# EAGLE design hdmilight (EAGLE 6.4)
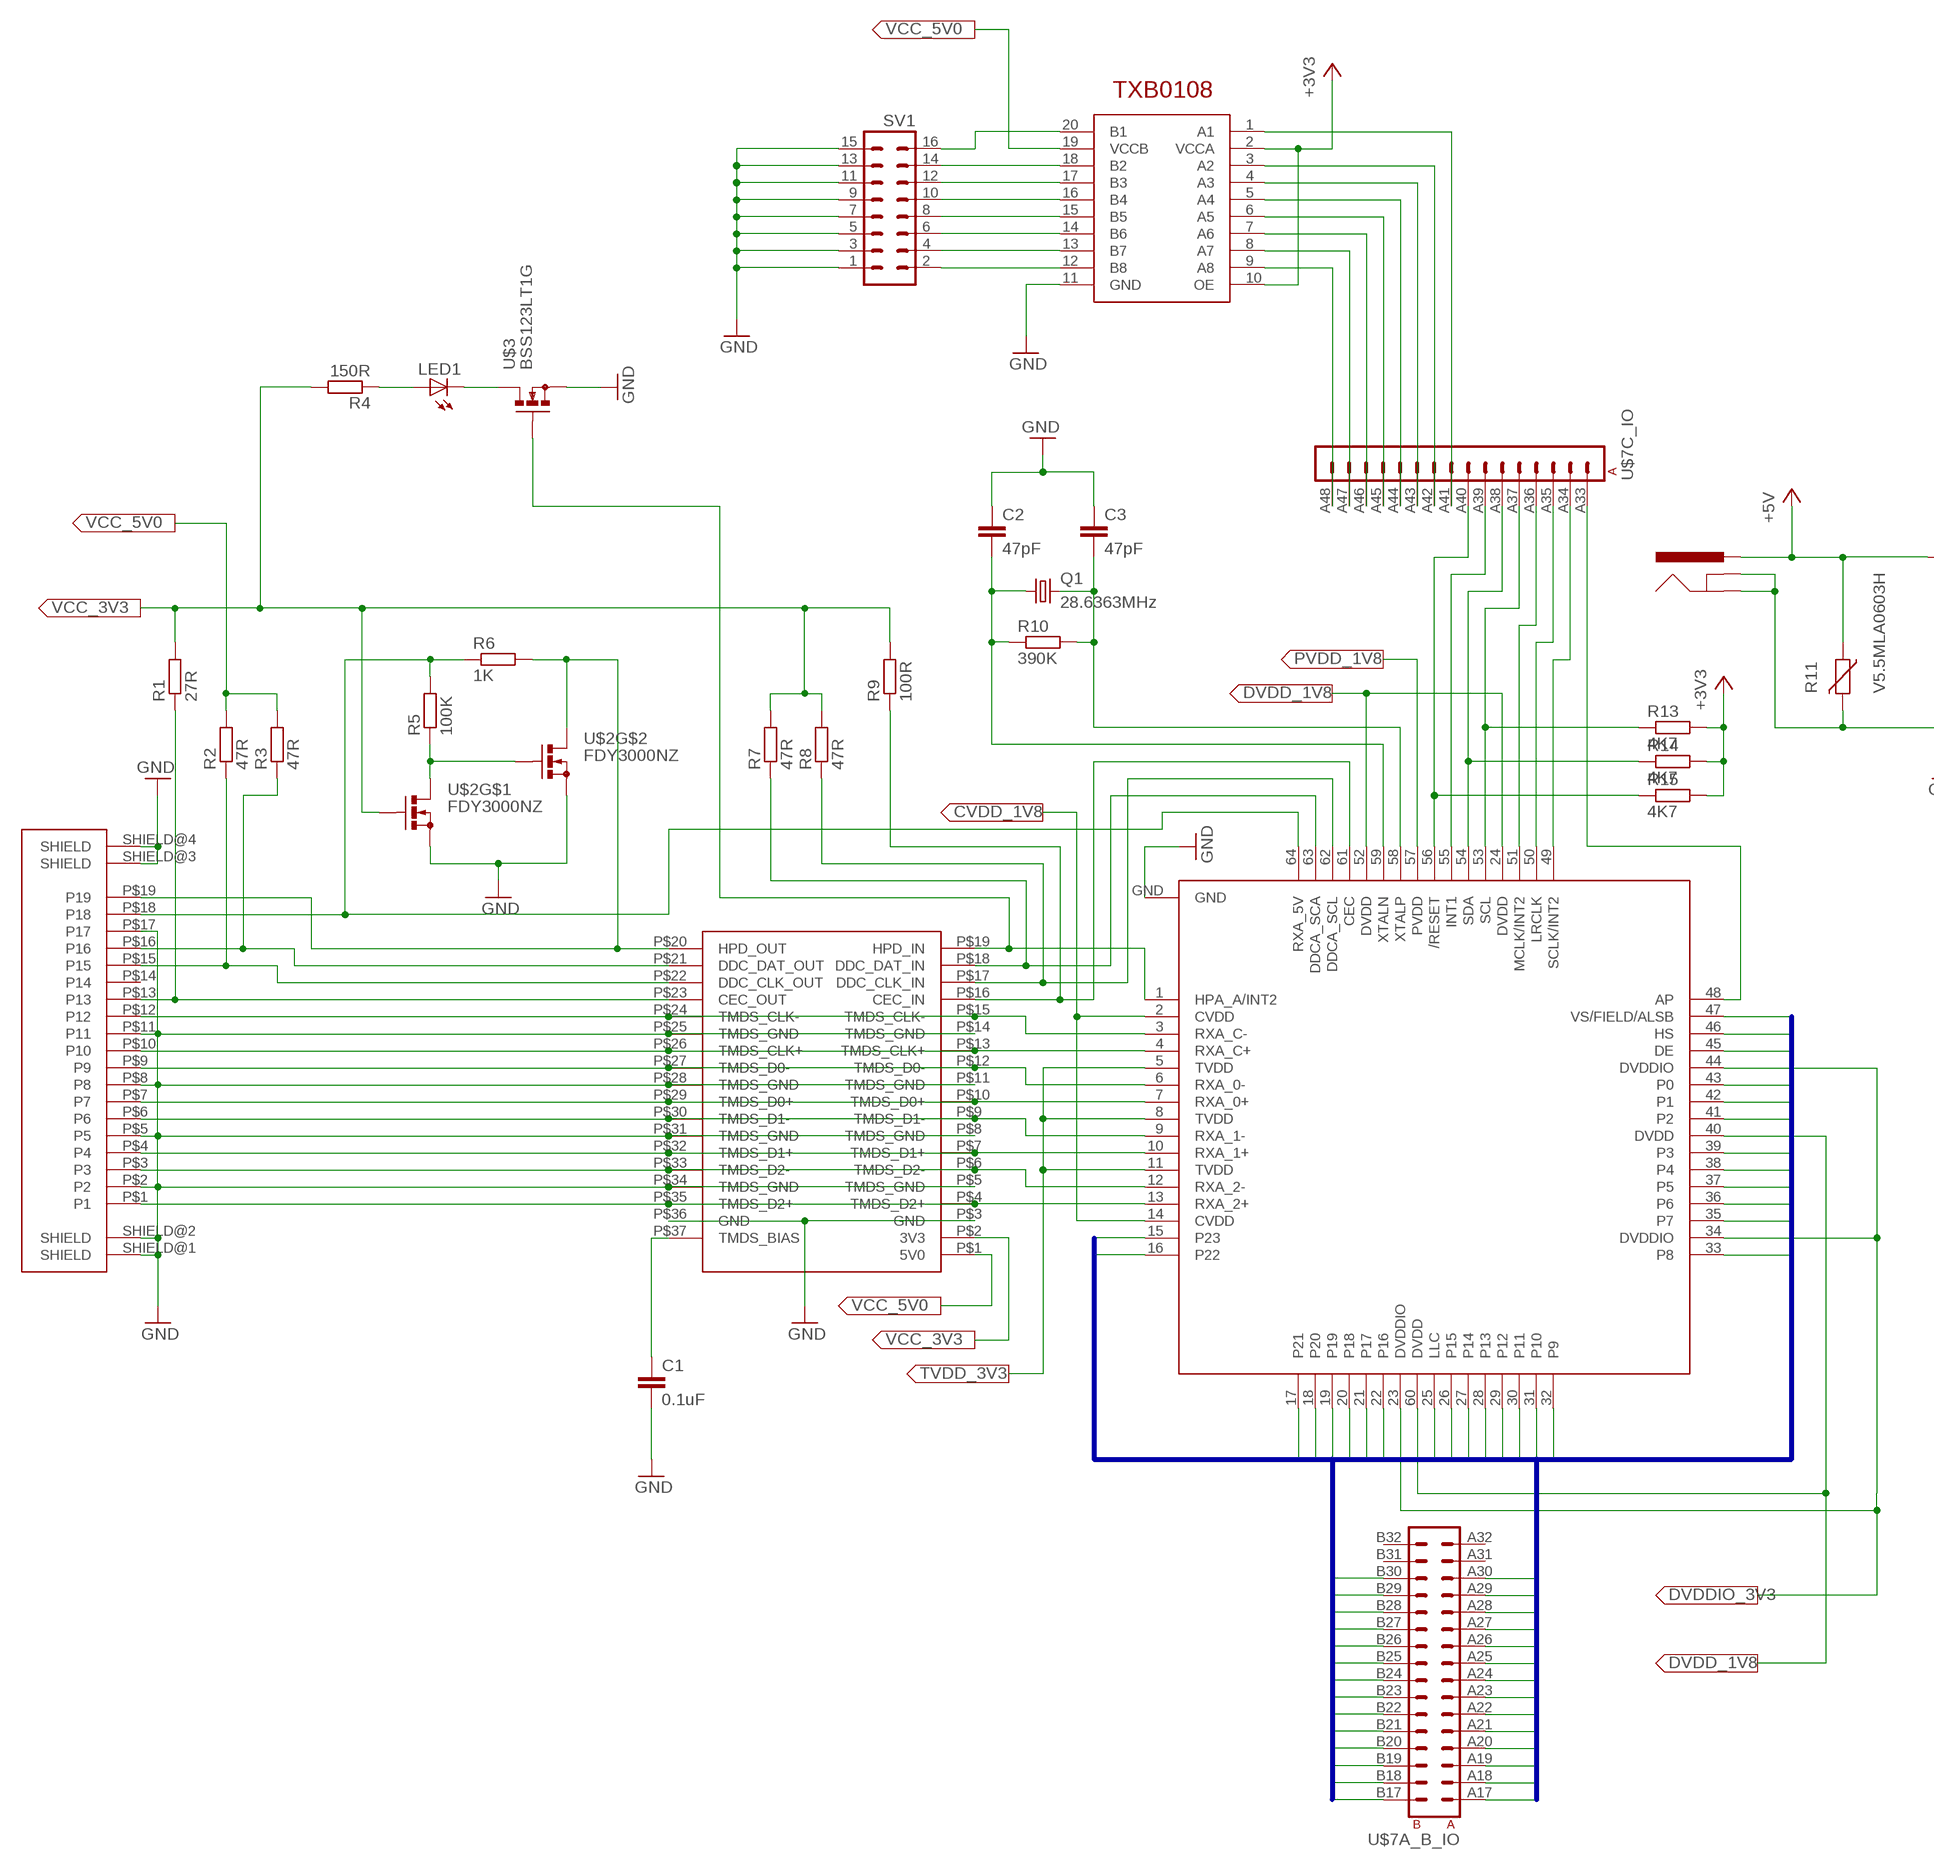
[diagram p0: schematic, sheet 1, part 1 of 2]
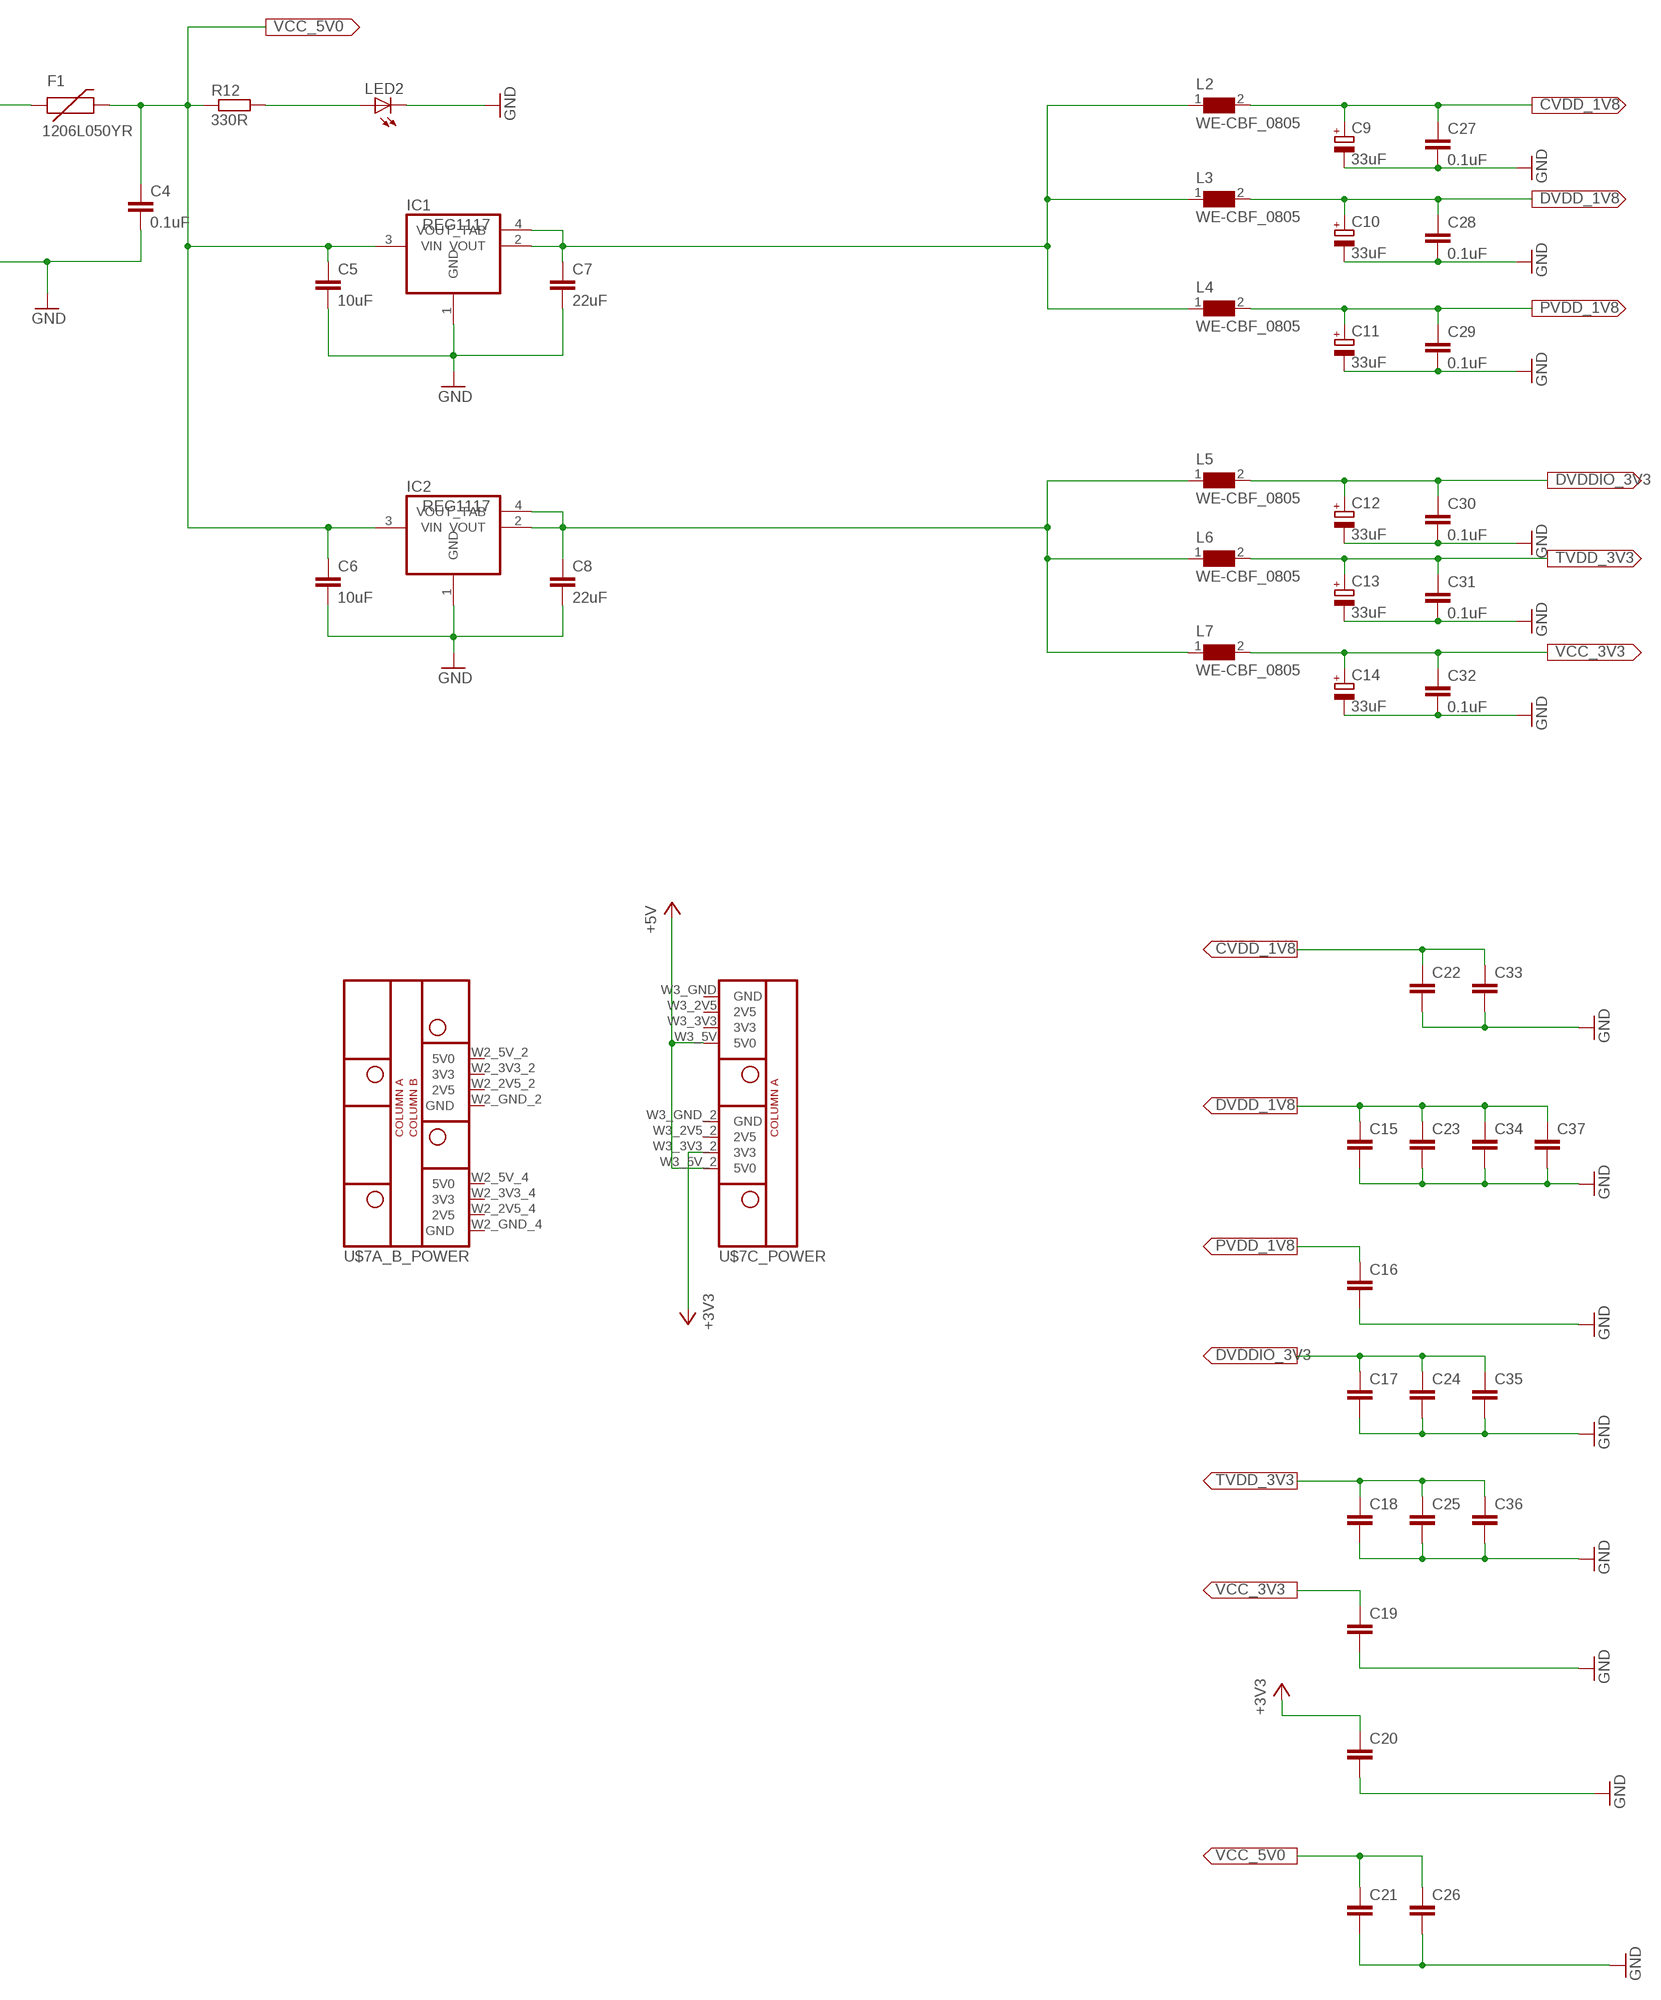
[diagram p1: schematic, sheet 1, part 2 of 2]

## Parts
C1  0.1uF  C-EUC0603  [C0603]
C2  47pF  C-EUC0603  [C0603]
C3  47pF  C-EUC0603  [C0603]
C4  0.1uF  C-EUC0603  [C0603]
C5  10uF  C-EUC1210  [C1210]
C6  10uF  C-EUC1210  [C1210]
C7  22uF  C-EUC1206  [C1206]
C8  22uF  C-EUC1206  [C1206]
C9  33uF  CPOL-EUSMCB  [SMC_B]
C10  33uF  CPOL-EUSMCB  [SMC_B]
C11  33uF  CPOL-EUSMCB  [SMC_B]
C12  33uF  CPOL-EUSMCB  [SMC_B]
C13  33uF  CPOL-EUSMCB  [SMC_B]
C14  33uF  CPOL-EUSMCB  [SMC_B]
C15  C-EUC0402  [C0402]
C16  C-EUC0603  [C0603]
C17  C-EUC0603  [C0603]
C18  C-EUC0402  [C0402]
C19  C-EUC0603  [C0603]
C20  C-EUC0603  [C0603]
C21  C-EUC0603  [C0603]
C22  C-EUC0603  [C0603]
C23  C-EUC0402  [C0402]
C24  C-EUC0603  [C0603]
C25  C-EUC0402  [C0402]
C26  C-EUC0603  [C0603]
C27  0.1uF  C-EUC0603  [C0603]
C28  0.1uF  C-EUC0603  [C0603]
C29  0.1uF  C-EUC0603  [C0603]
C30  0.1uF  C-EUC0603  [C0603]
C31  0.1uF  C-EUC0603  [C0603]
C32  0.1uF  C-EUC0603  [C0603]
C33  C-EUC0603  [C0603]
C34  C-EUC0402  [C0402]
C35  C-EUC0603  [C0603]
C36  C-EUC0402  [C0402]
C37  C-EUC0402  [C0402]
F1  1206L050YR  PTCSMD  [PTC-1206]
IC1  REG1117  [SOT223]
IC2  REG1117  [SOT223]
J1  POWER_JACKPTH  [POWER_JACK_PTH]
L2  WE-CBF_0805  [0805]
L3  WE-CBF_0805  [0805]
L4  WE-CBF_0805  [0805]
L5  WE-CBF_0805  [0805]
L6  WE-CBF_0805  [0805]
L7  WE-CBF_0805  [0805]
LED1  LEDCHIP-LED0805  [CHIP-LED0805]
LED2  LEDCHIP-LED0805  [CHIP-LED0805]
Q1  28.6363MHz  CRYSTALSM49  [SM49]
R1  27R  R-EU_R0603  [R0603]
R2  47R  R-EU_R0603  [R0603]
R3  47R  R-EU_R0603  [R0603]
R4  150R  R-EU_R0603  [R0603]
R5  100K  R-EU_R0603  [R0603]
R6  1K  R-EU_R0603  [R0603]
R7  47R  R-EU_R0603  [R0603]
R8  47R  R-EU_R0603  [R0603]
R9  100R  R-EU_R0603  [R0603]
R10  390K  R-EU_R0603  [R0603]
R11  V5.5MLA0603H  VARISTORCN0603  [CT/CN0603]
R12  330R  R-EU_R0603  [R0603]
R13  4K7  R-EU_R0603  [R0603]
R14  4K7  R-EU_R0603  [R0603]
R15  4K7  R-EU_R0603  [R0603]
SV1  MA08-2  [MA08-2]
U$1  FCI_HDMI_SOCKET_10029449-001RCF  [FCI_HDMI_SOCKET_10029449-001RCF]
U$2  FDY3000NZ  [SC89-6]
U$3  BSS123LT1G  [SOT23]
U$4  IP4776CZ38  [TSSOP38]
U$5  TXB0108  [TSSOP20]
U$6  ADV7611  [TQFP64-10X10]
U$7  MEGAWING_FULL_P1MEGAWING_P1  [MEGAWING_FULL_NOHOLES_P1]

## Nets
+3V3: C20.1 R13.2 R14.2 R15.2 U$5.2(VCCA) U$5.10(OE) U$7.W3_3V3_2(C_POWER:3V3)
+5V: F1.1 J1.PWR R11.1 U$7.W3_5V(C_POWER:5V0) U$7.W3_5V_2(C_POWER:5V0)
CVDD_1V8: C9.+ C22.1 C27.1 C33.1 L2.2 U$6.2(CVDD) U$6.14(CVDD)
DE: U$6.45(DE) U$7.B18(A_B_IO:B2)
DVDD_1V8: C10.+ C15.1 C23.1 C28.1 C34.1 C37.1 L3.2 U$6.24(DVDD) U$6.40(DVDD) U$6.52(DVDD) U$6.60(DVDD)
DVDDIO_3V3: C12.+ C17.1 C24.1 C30.1 C35.1 L5.2 U$6.23(DVDDIO) U$6.34(DVDDIO) U$6.44(DVDDIO)
GND: C1.2 C2.1 C3.1 C4.2 C5.2 C6.2 C7.2 C8.2 C9.- C10.- C11.- C12.- C13.- C14.- C15.2 C16.2 C17.2 C18.2 C19.2 C20.2 C21.2 C22.2 C23.2 C24.2 C25.2 C26.2 C27.2 C28.2 C29.2 C30.2 C31.2 C32.2 C33.2 C34.2 C35.2 C36.2 C37.2 IC1.1(GND) IC2.1(GND) J1.GND J1.GNDBREAK LED2.C R11.2 SV1.1 SV1.3 SV1.5 SV1.7 SV1.9 SV1.11 SV1.13 SV1.15 U$1.P$2(P2) U$1.P$5(P5) U$1.P$8(P8) U$1.P$11(P11) U$1.P$17(P17) U$1.SHIELD@1(SHIELD) U$1.SHIELD@2(SHIELD) U$1.SHIELD@3(SHIELD) U$1.SHIELD@4(SHIELD) U$2.P$1(S) U$2.P$4(S) U$3.2(S) U$4.P$3(GND) U$4.P$5(TMDS_GND) U$4.P$8(TMDS_GND) U$4.P$11(TMDS_GND) U$4.P$14(TMDS_GND) U$4.P$25(TMDS_GND) U$4.P$28(TMDS_GND) U$4.P$31(TMDS_GND) U$4.P$34(TMDS_GND) U$4.P$36(GND) U$5.11(GND) U$6.GND
HS: U$6.46(HS) U$7.A17(A_B_IO:A1)
LLC: U$6.25(LLC) U$7.A26(A_B_IO:A10)
N$1: U$1.P$1(P1) U$4.P$4(TMDS_D2+) U$4.P$35(TMDS_D2+) U$6.13(RXA_2+)
N$2: U$1.P$3(P3) U$4.P$6(TMDS_D2-) U$4.P$33(TMDS_D2-) U$6.12(RXA_2-)
N$3: U$1.P$4(P4) U$4.P$7(TMDS_D1+) U$4.P$32(TMDS_D1+) U$6.10(RXA_1+)
N$4: U$1.P$6(P6) U$4.P$9(TMDS_D1-) U$4.P$30(TMDS_D1-) U$6.9(RXA_1-)
N$5: U$1.P$7(P7) U$4.P$10(TMDS_D0+) U$4.P$29(TMDS_D0+) U$6.7(RXA_0+)
N$6: U$1.P$9(P9) U$4.P$12(TMDS_D0-) U$4.P$27(TMDS_D0-) U$6.6(RXA_0-)
N$7: U$1.P$10(P10) U$4.P$13(TMDS_CLK+) U$4.P$26(TMDS_CLK+) U$6.4(RXA_C+)
N$8: U$1.P$12(P12) U$4.P$15(TMDS_CLK-) U$4.P$24(TMDS_CLK-) U$6.3(RXA_C-)
N$13: R1.1 U$1.P$13(P13) U$4.P$23(CEC_OUT)
N$14: R2.1 U$1.P$15(P15) U$4.P$22(DDC_CLK_OUT)
N$15: R3.1 U$1.P$16(P16) U$4.P$21(DDC_DAT_OUT)
N$16: R6.2 U$1.P$19(P19) U$2.P$3(D) U$4.P$20(HPD_OUT)
N$18: SV1.2 U$5.12(B8)
N$19: LED2.A R12.2
N$20: R8.1 U$4.P$17(DDC_CLK_IN) U$6.62(DDCA_SCL)
N$21: C8.1 IC2.2(VOUT) IC2.4(VOUT_TAB) L5.1 L6.1 L7.1
N$22: C7.1 IC1.2(VOUT) IC1.4(VOUT_TAB) L2.1 L3.1 L4.1
N$23: R7.1 U$4.P$18(DDC_DAT_IN) U$6.63(DDCA_SCA)
N$24: R9.1 U$4.P$16(CEC_IN) U$6.61(CEC)
N$25: C2.2 Q1.1 R10.1 U$6.59(XTALN)
N$26: C3.2 Q1.2 R10.2 U$6.58(XTALP)
N$27: U$6.49(SCLK/INT2) U$7.A34(C_IO:A2)
N$28: U$6.50(LRCLK) U$7.A35(C_IO:A3)
N$29: U$6.48(AP) U$7.A33(C_IO:A1)
N$30: R13.1 U$6.53(SCL) U$7.A37(C_IO:A5)
N$31: R14.1 U$6.54(SDA) U$7.A38(C_IO:A6)
N$32: U$6.55(INT1) U$7.A39(C_IO:A7)
N$33: R15.1 U$6.56(/RESET) U$7.A40(C_IO:A8)
N$34: C1.1 U$4.P$37(TMDS_BIAS)
N$35: U$5.9(A8) U$7.A48(C_IO:A16)
N$36: U$5.8(A7) U$7.A47(C_IO:A15)
N$37: U$5.7(A6) U$7.A46(C_IO:A14)
N$38: U$5.6(A5) U$7.A45(C_IO:A13)
N$39: U$5.5(A4) U$7.A44(C_IO:A12)
N$40: U$5.4(A3) U$7.A43(C_IO:A11)
N$41: U$5.3(A2) U$7.A42(C_IO:A10)
N$43: U$6.51(MCLK/INT2) U$7.A36(C_IO:A4)
N$44: SV1.14 U$5.18(B2)
N$45: SV1.12 U$5.17(B3)
N$46: SV1.10 U$5.16(B4)
N$47: SV1.8 U$5.15(B5)
N$48: SV1.6 U$5.14(B6)
N$49: SV1.4 U$5.13(B7)
N$50: U$5.1(A1) U$7.A41(C_IO:A9)
N$51: SV1.16 U$5.20(B1)
N$52: R5.1 U$2.P$5(G) U$2.P$6(D)
N$53: R5.2 R6.1 U$1.P$18(P18) U$6.64(RXA_5V)
N$55: LED1.A R4.1
N$56: LED1.C U$3.3(D)
N$57: U$3.1(G) U$4.P$19(HPD_IN) U$6.1(HPA_A/INT2)
P0: U$6.43(P0) U$7.A18(A_B_IO:A2)
P1: U$6.42(P1) U$7.B19(A_B_IO:B3)
P2: U$6.41(P2) U$7.A19(A_B_IO:A3)
P3: U$6.39(P3) U$7.B20(A_B_IO:B4)
P4: U$6.38(P4) U$7.A20(A_B_IO:A4)
P5: U$6.37(P5) U$7.B21(A_B_IO:B5)
P6: U$6.36(P6) U$7.A21(A_B_IO:A5)
P7: U$6.35(P7) U$7.B22(A_B_IO:B6)
P8: U$6.33(P8) U$7.A22(A_B_IO:A6)
P9: U$6.32(P9) U$7.B23(A_B_IO:B7)
P10: U$6.31(P10) U$7.A23(A_B_IO:A7)
P11: U$6.30(P11) U$7.B24(A_B_IO:B8)
P12: U$6.29(P12) U$7.A24(A_B_IO:A8)
P13: U$6.28(P13) U$7.B25(A_B_IO:B9)
P14: U$6.27(P14) U$7.A25(A_B_IO:A9)
P15: U$6.26(P15) U$7.B26(A_B_IO:B10)
P16: U$6.22(P16) U$7.B27(A_B_IO:B11)
P17: U$6.21(P17) U$7.A27(A_B_IO:A11)
P18: U$6.20(P18) U$7.B28(A_B_IO:B12)
P19: U$6.19 U$7.A28(A_B_IO:A12)
P20: U$6.18(P20) U$7.B29(A_B_IO:B13)
P21: U$6.17(P21) U$7.A29(A_B_IO:A13)
P22: U$6.16(P22) U$7.B30(A_B_IO:B14)
P23: U$6.15(P23) U$7.A30(A_B_IO:A14)
PVDD_1V8: C11.+ C16.1 C29.1 L4.2 U$6.57(PVDD)
TVDD_3V3: C13.+ C18.1 C25.1 C31.1 C36.1 L6.2 U$6.5(TVDD) U$6.8(TVDD) U$6.11(TVDD)
VCC_3V3: C14.+ C19.1 C32.1 L7.2 R1.2 R4.2 R7.2 R8.2 R9.2 U$2.P$2(G) U$4.P$2(3V3)
VCC_5V0: C4.1 C5.1 C6.1 C21.1 C26.1 F1.2 IC1.3(VIN) IC2.3(VIN) R2.2 R3.2 R12.1 U$4.P$1(5V0) U$5.19(VCCB)
VS: U$6.47(VS/FIELD/ALSB) U$7.B17(A_B_IO:B1)
Unconnected: U$1.P$14(P14) U$7.A31(A_B_IO:A15) U$7.A32(A_B_IO:A16) U$7.B31(A_B_IO:B15) U$7.B32(A_B_IO:B16) U$7.W2_2V5_2(A_B_POWER:2V5) U$7.W2_2V5_4(A_B_POWER:2V5) U$7.W2_3V3_2(A_B_POWER:3V3) U$7.W2_3V3_4(A_B_POWER:3V3) U$7.W2_5V_2(A_B_POWER:5V0) U$7.W2_5V_4(A_B_POWER:5V0) U$7.W3_2V5(C_POWER:2V5) U$7.W3_2V5_2(C_POWER:2V5) U$7.W3_3V3(C_POWER:3V3)

## Buses
P[0..23],LLC,DE,HS,VS

## Power pins joined to a net without a drawn wire
GND: U$7.W2_GND_2(A_B_POWER:GND) U$7.W2_GND_4(A_B_POWER:GND) U$7.W3_GND(C_POWER:GND) U$7.W3_GND_2(C_POWER:GND)

## Library data of the parts
C1 C4 C27-C32 = resistor:C-EU: CAPACITOR, European symbol; MF: AVX; MPN: 02016D104KAT2A; OC_FARNELL: 1657913
C2 C3 = resistor:C-EU: CAPACITOR, European symbol; MF: AVX; MPN: 02013A470JAT2A; OC_FARNELL: 1657909RL
C5 C6 = resistor:C-EU: CAPACITOR, European symbol; MF: AVX; MPN: 06034D106MAT2A; OC_FARNELL: 1657928
C7 C8 = resistor:C-EU: CAPACITOR, European symbol; MF: AVX; MPN: 06034D226MAT2A; OC_FARNELL: 2094041RL
C9-C14 = resistor:CPOL-EU: POLARIZED CAPACITOR, European symbol; MF: RUBYCON; MPN: 100ZLJ33M8X11.5; OC_FARNELL: 2102458
C15 C18 C23 C25 C34 C36 C37 = resistor:C-EU: CAPACITOR, European symbol; MF: AVX; MPN: 04025A150JAT2A; OC_FARNELL: 1327631
C16 C17 C19-C22 C24 C26 C33 C35 = resistor:C-EU: CAPACITOR, European symbol; MF: AVX; MPN: 06031A100JAT2A; OC_FARNELL: 1658863
F1 = SparkFun:PTC: Resettable Fuse PTC Resettable Fuse. Spark Fun Electronics SKU : COM-08357; MF: LITTELFUSE; MPN: 1206L050YR; OC_FARNELL: 1596993
IC1 IC2 = burr-brown:REG1117: 800mA and 1A Low Dropout (LDO) Positive Regulator 1.8V, 2.5V, 2.85V, 3.3V, 5V, and Adj; MF: TEXAS INSTRUMENTS; MPN: REG1117; OC_FARNELL: 1097566; OC_NEWARK: 14P6981
J1 = SparkFun:POWER_JACK: Power Jack This is the standard 5.5mm barrel jack for power. The PTH is the most common, proven, reliable, footprint. All others are experimental. The Slot footprint only works if the mill layer is transmitted to the PCB fab house so be warned. Spark Fun Electronics SKU : PRT-00119. Mating wall wart : TOL-00298 (and others); OC_FARNELL: unknown
L2-L7 = EagleLibrary_Wuerth_Elektronik_eiSos_Version_6:WE-CBF: SMD EMI Suppression Ferrite Beads WE-CBF - Excellent anti-EMI properties - Low DC-restistance - Impedances till 3000 ohms - Rated current up to 6 A -- Reliable Ni-Sn electrodes -- Perfect as data lined filter and for uncoupling of distribution voltage; OC_FARNELL: unknown
LED1 LED2 = led:LED: LED OSRAM: - CHIPLED LG R971, LG N971, LY N971, LG Q971, LY Q971, LO R971, LY R971 LH N974, LH R974 LS Q976, LO Q976, LY Q976 LO Q996 - Hyper CHIPLED LW Q18S LB Q993, LB Q99A, LB R99A - SideLED LS A670, LO A670, LY A670, LG A670, LP A670 LB A673, LV A673, LT A673, LW A673 LH A674 LY A675 LS A676, LA A676, LO A676, LY A676, LW A676 LS A679, LY A679, LG A679 - Hyper Micro SIDELED® LS Y876, LA Y876, LO Y876, LY Y876 LT Y87S - SmartLED LW L88C, LW L88S LB L89C, LB L89S, LG L890 LS L89K, LO L89K, LY L89K LS L896, LA L896, LO L896, LY L896 - TOPLED LS T670, LO T670, LY T670, LG T670, LP T670 LSG T670, LSP T670, LSY T670, LOP T670, LYG T670 LG T671, LOG T671, LSG T671 LB T673, LV T673, LT T673, LW T673 LH T674 LS T676, LA T676, LO T676, LY T676, LB T676, LH T676, LSB T676, LW T676 LB T67C, LV T67C, LT T67C, LS T67K, LO T67K, LY T67K, LW E67C LS E67B, LA E67B, LO E67B, LY E67B, LB E67C, LV E67C, LT E67C LW T67C LS T679, LY T679, LG T679 LS T770, LO T770, LY T770, LG T770, LP T770 LB T773, LV T773, LT T773, LW T773 LH T774 LS E675, LA E675, LY E675, LS T675 LS T776, LA T776, LO T776, LY T776, LB T776 LHGB T686 LT T68C, LB T68C - Hyper Mini TOPLED® LB M676 - Mini TOPLED Santana® LG M470 LS M47K, LO M47K, LY M47K Source: http://www.osram.convergy.de LUXEON: - LUMILED® LXK2-PW12-R00, LXK2-PW12-S00, LXK2-PW14-U00, LXK2-PW14-V00 LXK2-PM12-R00, LXK2-PM12-S00, LXK2-PM14-U00 LXK2-PE12-Q00, LXK2-PE12-R00, LXK2-PE12-S00, LXK2-PE14-T00, LXK2-PE14-U00 LXK2-PB12-K00, LXK2-PB12-L00, LXK2-PB12-M00, LXK2-PB14-N00, LXK2-PB14-P00, LXK2-PB14-Q00 LXK2-PR12-L00, LXK2-PR12-M00, LXK2-PR14-Q00, LXK2-PR14-R00 LXK2-PD12-Q00, LXK2-PD12-R00, LXK2-PD12-S00 LXK2-PH12-R00, LXK2-PH12-S00 LXK2-PL12-P00, LXK2-PL12-Q00, LXK2-PL12-R00 Source: www.luxeon.com KINGBRIGHT: KA-3528ASYC Source: www.kingbright.com; OC_FARNELL: unknown
Q1 = crystal:CRYSTAL: CRYSTAL; OC_FARNELL: unknown; OC_NEWARK: unknown
R1-R4 R7 R8 R10 R12-R15 = resistor:R-EU_: RESISTOR, European symbol; OC_FARNELL: unknown
R5 = resistor:R-EU_: RESISTOR, European symbol; MF: AVX; MPN: 04025A100KAT2A; OC_FARNELL: 2332492RL
R6 = resistor:R-EU_: RESISTOR, European symbol; MF: MICROCHIP; MPN: 11AA010-I/P; OC_FARNELL: 1578282
R9 = resistor:R-EU_: RESISTOR, European symbol; MF: LABFACILITY; MPN: 010010TD; OC_FARNELL: 7255743
R11 = varistor:VARISTOR: VARISTOR; OC_FARNELL: unknown
SV1 = con-lstb:MA08-2: PIN HEADER; OC_FARNELL: unknown; OC_NEWARK: unknown
U$1 = __SR:FCI_HDMI_SOCKET_10029449-001RCF; OC_FARNELL: unknown
U$2 = __SR:FDY3000NZ; OC_FARNELL: unknown
U$3 = __SR:BSS123LT1G; OC_FARNELL: unknown
U$4 = __SR:IP4776CZ38; OC_FARNELL: unknown
U$5 = __SR:TXB0108; OC_FARNELL: unknown
U$6 = __SR:ADV7611; OC_FARNELL: unknown
U$7 = __SR:MEGAWING_FULL_P1; OC_FARNELL: unknown

## Board
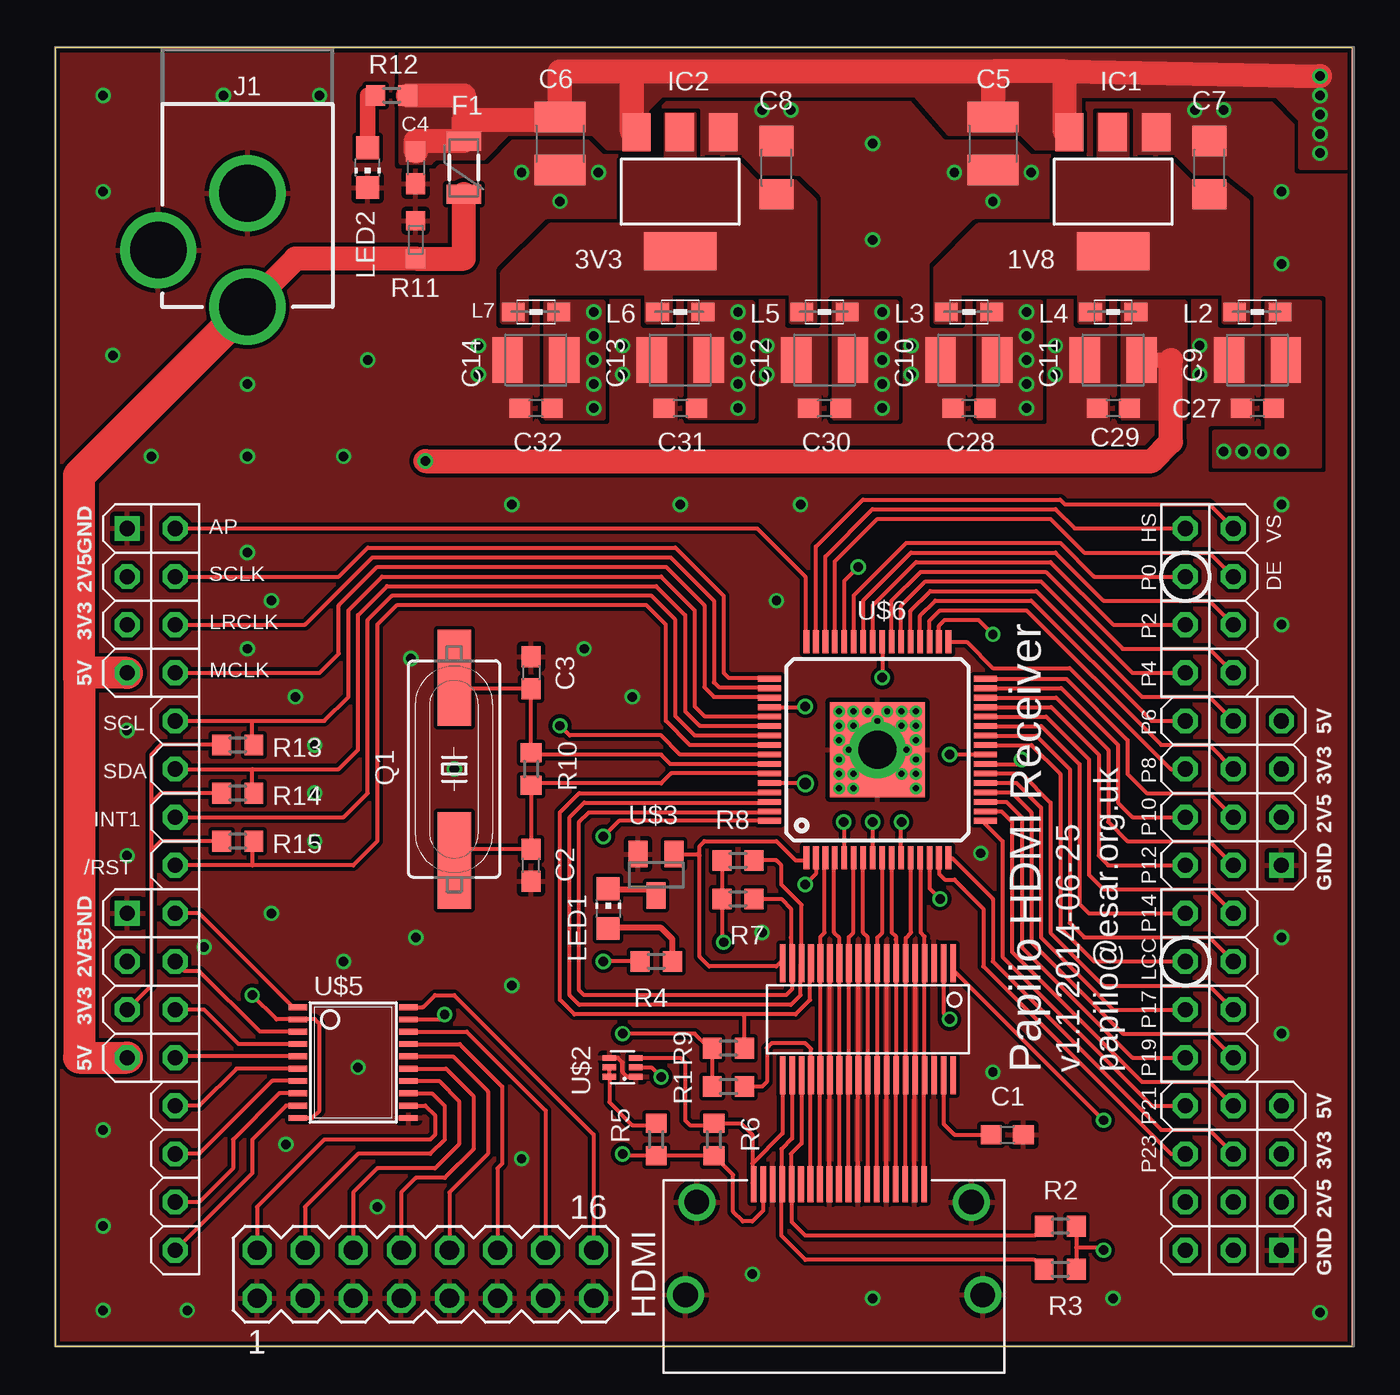
[diagram p2: board, top side]
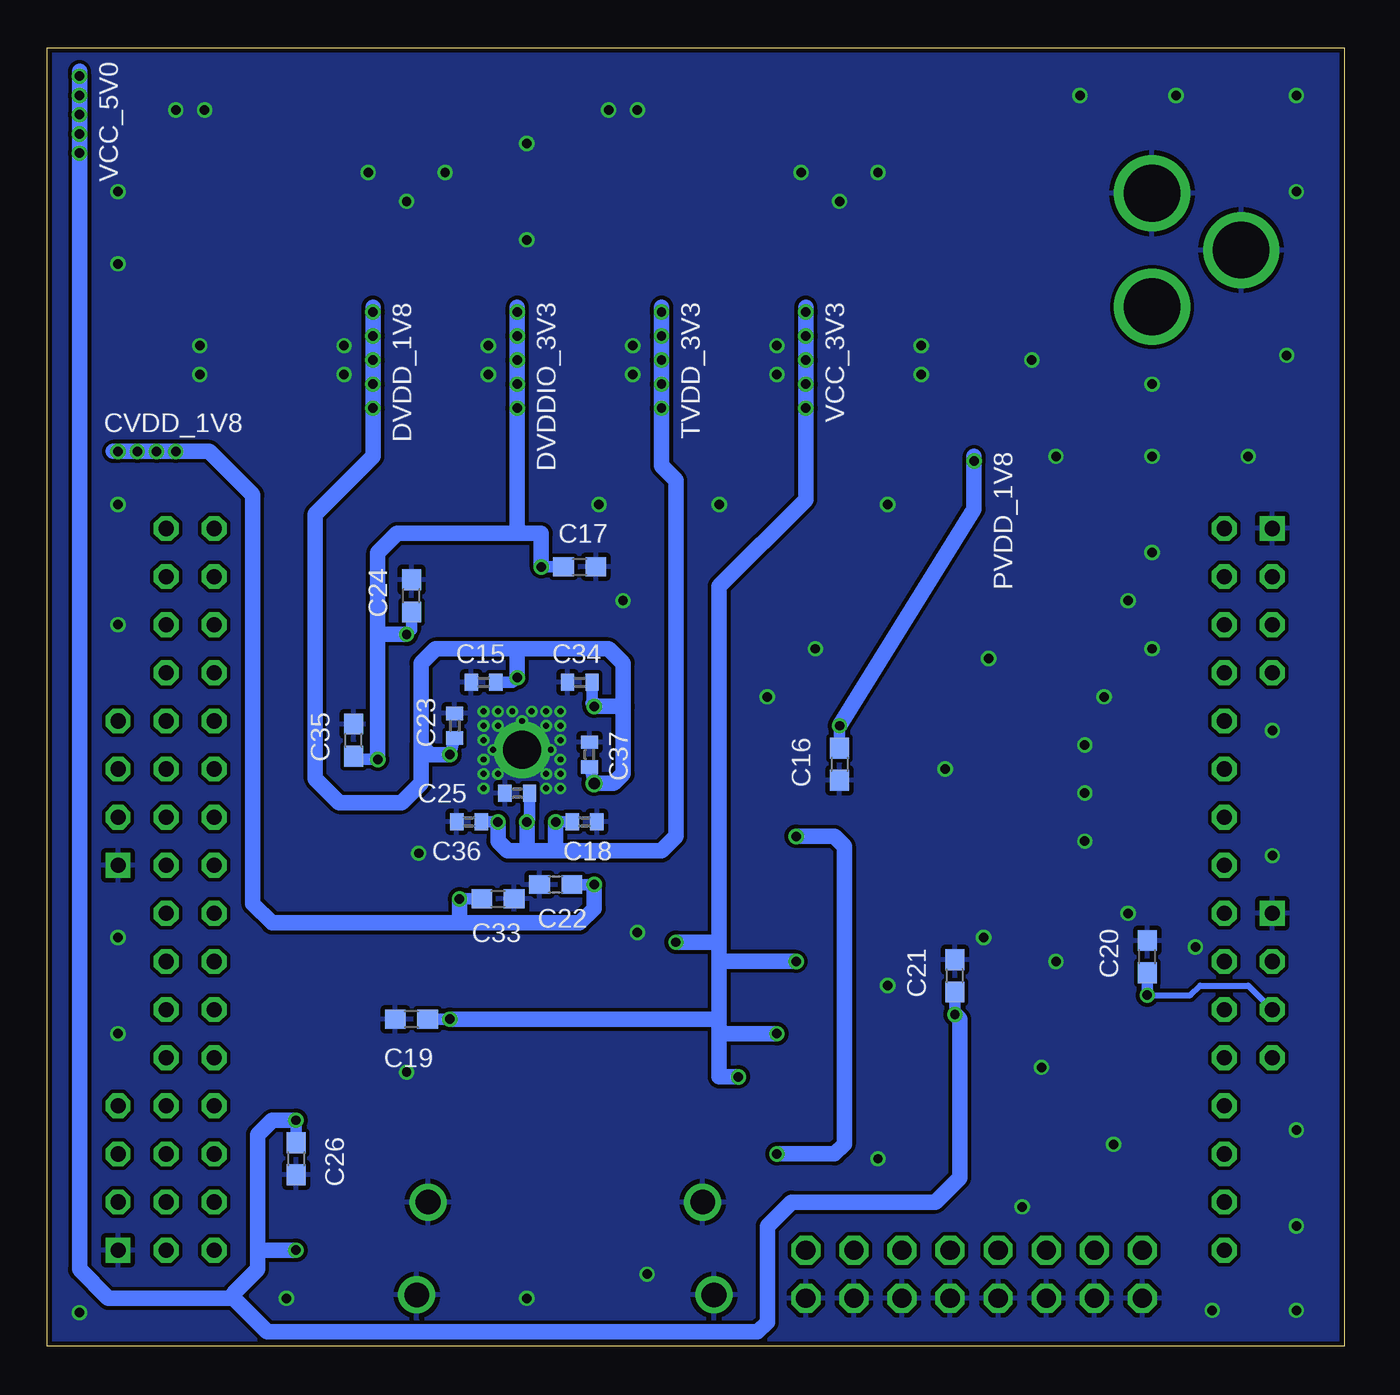
[diagram p3: board, bottom side, seen from below]

Size 68.5 x 68.57 mm. Coordinates in mm from the lower left corner, seen from the top.
Outline: 0,0 68.5,0 68.5,68.57 0,68.57 0,0
Copper layers (1*16): Top 0.035mm / dielectric 1.5mm / Bottom 0.035mm
Design rules "Fusion_eagle_rule_v1.1": minimum track width 6mil, minimum drill 12mil, track to track 6mil, track to pad 6mil, pad to pad 6mil, via to via 6mil, smd to smd 0mil, copper to edge 10mil, drill to drill 10mil, minimum pad ring 10mil, minimum via ring 6mil, stop-mask expansion 2mil, vias tented up to drill 100mil, thermal gap 10mil

### Footprints (pad centres in the part's own frame; a part is rotated, then mirrored left to right if it is on the bottom)
C0603 = smd 1.1 x 1: 1 -0.85,0; 2 0.85,0
C1210 = smd 1.6 x 2.7: 1 -1.4,0; 2 1.4,0
C1206 = smd 1.6 x 1.8: 1 -1.4,0; 2 1.4,0
SMC_B = smd 1.6 x 2.4: + -1.5,0; - 1.5,0
C0402 = smd 0.7 x 0.9: 1 -0.65,0; 2 0.65,0
PTC-1206 = smd 1 x 1.8: 1 -1.4,0; 2 1.4,0
SOT223 = smd 1.499 x 2.007: 1 -2.261,-3.15; 2 0.025,-3.15; 3 2.311,-3.15 | smd 3.81 x 2.007: 4 0,3.15
POWER_JACK_PTH = drill 2.997: GND 0,7.7; GNDBREAK 4.7,10.7; PWR 0,13.7
0805 = smd 1.2 x 1: 1 -1.2,0; 2 1.2,0
CHIP-LED0805 = smd 1.2 x 1.2: A 0,-1.05; C 0,1.05
SM49 = smd 5.08 x 1.778: 1 -4.826,0; 2 4.826,0
R0603 = smd 1 x 1.1: 1 -0.85,0; 2 0.85,0
CT/CN0603 = smd 1 x 1: 1 -1,0; 2 1,0
MA08-2 = drill 1.016 octagon: 1 -8.89,-1.27; 2 -8.89,1.27; 3 -6.35,-1.27; 4 -6.35,1.27; 5 -3.81,-1.27; 6 -3.81,1.27; 7 -1.27,-1.27; 8 -1.27,1.27; 9 1.27,-1.27; 10 1.27,1.27; 11 3.81,-1.27; 12 3.81,1.27; 13 6.35,-1.27; 14 6.35,1.27; 15 8.89,-1.27; 16 8.89,1.27
FCI_HDMI_SOCKET_10029449-001RCF = smd 0.3 x 1.9: P$1 4.75,0.95; P$2 4.25,0.95; P$3 3.75,0.95; P$4 3.25,0.95; P$5 2.75,0.95; P$6 2.25,0.95; P$7 1.75,0.95; P$8 1.25,0.95; P$9 0.75,0.95; P$10 0.25,0.95; P$11 -0.25,0.95; P$12 -0.75,0.95; P$13 -1.25,0.95; P$14 -1.75,0.95; P$15 -2.25,0.95; P$16 -2.75,0.95; P$17 -3.25,0.95; P$18 -3.75,0.95; P$19 -4.25,0.95 | drill 1.3: SHIELD@1 -7.25,0; SHIELD@2 -7.85,-4.9; SHIELD@3 7.25,0; SHIELD@4 7.85,-4.9
SC89-6 = smd 0.3 x 0.7: P$1 -0.5,-0.7; P$2 0,-0.7; P$3 0.5,-0.7; P$4 0.5,0.7; P$5 0,0.7; P$6 -0.5,0.7
SOT23 = smd 1 x 1.4: 1 -0.95,-1.1; 2 0.95,-1.1; 3 0,1.1
TSSOP38 = smd 0.3 x 2: P$1 -4.5,-2.95; P$2 -4,-2.95; P$3 -3.5,-2.95; P$4 -3,-2.95; P$5 -2.5,-2.95; P$6 -2,-2.95; P$7 -1.5,-2.95; P$8 -1,-2.95; P$9 -0.5,-2.95; P$10 0,-2.95; P$11 0.5,-2.95; P$12 1,-2.95; P$13 1.5,-2.95; P$14 2,-2.95; P$15 2.5,-2.95; P$16 3,-2.95; P$17 3.5,-2.95; P$18 4,-2.95; P$19 4.5,-2.95; P$20 4.5,2.95; P$21 4,2.95; P$22 3.5,2.95; P$23 3,2.95; P$24 2.5,2.95; P$25 2,2.95; P$26 1.5,2.95; P$27 1,2.95; P$28 0.5,2.95; P$29 0,2.95; P$30 -0.5,2.95; P$31 -1,2.95; P$32 -1.5,2.95; P$33 -2,2.95; P$34 -2.5,2.95; P$35 -3,2.95; P$36 -3.5,2.95; P$37 -4,2.95; P$38 -4.5,2.95
TSSOP20 = smd 0.305 x 0.991: 1 -2.925,-2.918; 2 -2.275,-2.918; 3 -1.625,-2.918; 4 -0.975,-2.918; 5 -0.325,-2.918; 6 0.325,-2.918; 7 0.975,-2.918; 8 1.625,-2.918; 9 2.275,-2.918; 10 2.925,-2.918; 11 2.925,2.918; 12 2.275,2.918; 13 1.625,2.918; 14 0.975,2.918; 15 0.325,2.918; 16 -0.325,2.918; 17 -0.975,2.918; 18 -1.625,2.918; 19 -2.275,2.918; 20 -2.925,2.918
TQFP64-10X10 = smd 1.2 x 0.3: 1 -5.7,3.75; 2 -5.7,3.25; 3 -5.7,2.75; 4 -5.7,2.25; 5 -5.7,1.75; 6 -5.7,1.25; 7 -5.7,0.75; 8 -5.7,0.25; 9 -5.7,-0.25; 10 -5.7,-0.75; 11 -5.7,-1.25; 12 -5.7,-1.75; 13 -5.7,-2.25; 14 -5.7,-2.75; 15 -5.7,-3.25; 16 -5.7,-3.75; 33 5.7,-3.75; 34 5.7,-3.25; 35 5.7,-2.75; 36 5.7,-2.25; 37 5.7,-1.75; 38 5.7,-1.25; 39 5.7,-0.75; 40 5.7,-0.25; 41 5.7,0.25; 42 5.7,0.75; 43 5.7,1.25; 44 5.7,1.75; 45 5.7,2.25; 46 5.7,2.75; 47 5.7,3.25; 48 5.7,3.75 | smd 0.3 x 1.2: 17 -3.75,-5.7; 18 -3.25,-5.7; 19 -2.75,-5.7; 20 -2.25,-5.7; 21 -1.75,-5.7; 22 -1.25,-5.7; 23 -0.75,-5.7; 24 -0.25,-5.7; 25 0.25,-5.7; 26 0.75,-5.7; 27 1.25,-5.7; 28 1.75,-5.7; 29 2.25,-5.7; 30 2.75,-5.7; 31 3.25,-5.7; 32 3.75,-5.7; 49 3.75,5.7; 50 3.25,5.7; 51 2.75,5.7; 52 2.25,5.7; 53 1.75,5.7; 54 1.25,5.7; 55 0.75,5.7; 56 0.25,5.7; 57 -0.25,5.7; 58 -0.75,5.7; 59 -1.25,5.7; 60 -1.75,5.7; 61 -2.25,5.7; 62 -2.75,5.7; 63 -3.25,5.7; 64 -3.75,5.7 | smd 5 x 5: GND 0,0
MEGAWING_FULL_NOHOLES_P1 = drill 0.8 octagon: A17 59.69,43.18; A18 59.69,40.64; A19 59.69,38.1; A20 59.69,35.56; A21 59.69,33.02; A22 59.69,30.48; A23 59.69,27.94; A24 59.69,25.4; A25 59.69,22.86; A26 59.69,20.32; A27 59.69,17.78; A28 59.69,15.24; A29 59.69,12.7; A30 59.69,10.16; A31 59.69,7.62; A32 59.69,5.08; A33 6.35,43.18; A34 6.35,40.64; A35 6.35,38.1; A36 6.35,35.56; A37 6.35,33.02; A38 6.35,30.48; A39 6.35,27.94; A40 6.35,25.4; A41 6.35,22.86; A42 6.35,20.32; A43 6.35,17.78; A44 6.35,15.24; A45 6.35,12.7; A46 6.35,10.16; A47 6.35,7.62; A48 6.35,5.08; B17 62.23,43.18; B18 62.23,40.64; B19 62.23,38.1; B20 62.23,35.56; B21 62.23,33.02; B22 62.23,30.48; B23 62.23,27.94; B24 62.23,25.4; B25 62.23,22.86; B26 62.23,20.32; B27 62.23,17.78; B28 62.23,15.24; B29 62.23,12.7; B30 62.23,10.16; B31 62.23,7.62; B32 62.23,5.08; W2_2V5_2 64.77,27.94; W2_2V5_4 64.77,7.62; W2_3V3_2 64.77,30.48; W2_3V3_4 64.77,10.16; W2_5V_2 64.77,33.02; W2_5V_4 64.77,12.7; W3_2V5 3.81,40.64; W3_2V5_2 3.81,20.32; W3_3V3 3.81,38.1; W3_3V3_2 3.81,17.78; W3_5V 3.81,35.56; W3_5V_2 3.81,15.24 | drill 0.8 square: W2_GND_2 64.77,25.4; W2_GND_4 64.77,5.08; W3_GND 3.81,43.18; W3_GND_2 3.81,22.86

### Placement (x,y rotation side)
C1  50.29,11.18 0 top
C2  25.15,25.4 90 top
C3  25.15,35.56 270 top
C4  19.05,62.23 270 top
C5  49.53,63.5 270 top
C6  26.67,63.5 270 top
C7  60.96,62.23 90 top
C8  38.1,62.23 90 top
C9  63.5,52.07 180 top
C10  48.26,52.07 180 top
C11  55.88,52.07 180 top
C12  40.64,52.07 180 top
C13  33.02,52.07 180 top
C14  25.4,52.07 180 top
C15  45.47,35.05 180 bottom
C16  26.67,30.73 270 bottom
C17  40.39,41.15 0 bottom
C18  40.13,27.69 0 bottom
C19  49.28,17.27 180 bottom
C20  10.41,20.57 90 bottom
C21  20.57,19.56 90 bottom
C22  41.66,24.38 180 bottom
C23  46.99,32.77 90 bottom
C24  49.28,39.62 90 bottom
C25  43.69,29.21 180 bottom
C26  55.37,9.91 270 bottom
C27  63.5,49.53 180 top
C28  48.26,49.53 180 top
C29  55.88,49.53 180 top
C30  40.64,49.53 180 top
C31  33.02,49.53 180 top
C32  25.4,49.53 180 top
C33  44.7,23.62 0 bottom
C34  40.39,35.05 180 bottom
C35  52.32,32 90 bottom
C36  46.23,27.69 180 bottom
C37  39.88,31.24 90 bottom
F1  21.59,62.23 90 top
IC1  55.88,60.96 180 top
IC2  33.02,60.96 180 top
J1  10.16,68.58 180 top
L2  63.5,54.61 0 top
L3  48.26,54.61 0 top
L4  55.88,54.61 0 top
L5  40.64,54.61 0 top
L6  33.02,54.61 0 top
L7  25.4,54.61 0 top
LED1  29.21,23.11 0 top
LED2  16.51,62.23 180 top
Q1  21.08,30.48 90 top
R1  35.56,13.72 180 top
R2  53.09,6.35 0 top
R3  53.09,4.06 0 top
R4  31.75,20.32 180 top
R5  31.75,10.92 270 top
R6  34.8,10.92 90 top
R7  36.07,23.62 180 top
R8  36.07,25.65 180 top
R9  35.56,15.75 180 top
R10  25.15,30.48 90 top
R11  19.05,58.42 90 top
R12  17.78,66.04 180 top
R13  9.65,31.75 180 top
R14  9.65,29.21 180 top
R15  9.65,26.67 180 top
SV1  19.56,3.81 0 top
U$1  41.15,7.62 0 top
U$2  29.97,14.73 90 top
U$3  31.75,24.89 180 top
U$4  42.93,17.27 180 top
U$5  15.75,14.99 270 top
U$6  43.43,31.5 90 top
U$7  0,0 0 top

### Tracks (layer width: path | path; a pad name or v marks a point on that pad's centre or on a via)
+3V3  (via drill 0.5)
  Top 0.203: U$5.10 13.59,12.06 13.97,12.45 13.97,17.02 13.72,17.27 12.84,17.27 U$5.2 11.7,17.26 v10.41,18.54 | R13.2 5.59,31.75 5.08,31.24 5.08,28.7 | R15.2 5.59,26.67 5.08,26.16 | 5.08,26.16 5.08,19.05 U$7.W3_3V3_2 | R14.2 5.59,29.21 5.08,28.7 | 5.08,28.7 5.08,26.16
  Bottom 0.305: v10.41,18.54 8.13,18.54 7.62,19.05 5.08,19.05 U$7.W3_3V3_2
  Bottom 0.61: C20.1 v10.41,18.54
+5V
  Top 1.27: J1.PWR 12.7,57.42 R11.1 21.59,57.42 F1.1
  Top 1.676: 1.27,35.31 1.27,15.24 U$7.W3_5V_2 | U$7.W3_5V 1.52,35.56 1.27,35.31 | 1.27,35.31 1.27,45.99 J1.PWR
CVDD_1V8  (via drill 0.5)
  Top 0.203: U$6.14 46.18,24.17 v46.74,23.62 | U$6.2 40.18,24.94 v39.62,24.38
  Bottom 0.61: 39.74,23.76 v39.62,24.38 C22.1 | 46.62,23.51 v46.74,23.62 C33.1
  Bottom 0.813: 46.74,22.35 56.64,22.35 57.66,23.37 57.66,44.96 59.94,47.24 v63.75,47.24 v64.77,47.24 65.02,47.24 | 46.74,22.35 40.39,22.35 39.62,23.11 v39.62,24.38 | v46.74,23.62 46.74,22.35
  other vias: 62.74,47.24 61.72,47.24
  pour Top (no thermals): 64.01,55.12 64.01,48.26 61.21,48.26 61.21,46.48 66.8,46.48 66.8,55.12
DE
  Top 0.203: U$6.45 41.18,41.44 43.43,43.69 52.58,43.69 54.36,41.91 60.96,41.91 U$7.B18
DVDD_1V8  (via drill 0.5, 0.6)
  Top 0.203: U$6.52 39.59,33.75 v39.62,33.78 | U$6.60 39.6,29.75 v39.62,29.72 | U$6.40 v43.68,35.31 v43.69,35.31 | U$6.24 v47.25,31.25 v47.24,31.24
  Bottom 0.61: 39.48,33.92 v39.62,33.78 | C23.1 v47.24,31.24 | C37.1 v39.62,29.72 | 39.79,33.95 v39.62,33.78 | C15.1 43.94,35.05 v43.69,35.31 | C34.1 39.74,33.89 v39.62,33.78
  Bottom 0.813: v39.62,29.72 38.61,29.72 38.1,30.23 38.1,33.78 | 38.1,33.78 38.1,36.07 38.86,36.83 43.69,36.83 | 43.69,36.83 48.01,36.83 48.77,36.07 48.77,31.75 | 48.77,31.75 48.26,31.24 v47.24,31.24 | 43.69,36.83 v43.69,35.31 | 38.1,33.78 v39.62,33.78 | 48.77,31.75 48.77,29.72 49.78,28.7 53.09,28.7 54.36,29.97 54.36,43.94 51.31,46.99 v51.31,54.61 51.31,54.86
  other vias: 51.31,53.34 51.31,52.07 51.31,50.8 51.31,49.53
  pour Top (no thermals): 48.77,55.12 48.77,49.02 52.07,49.02 52.07,55.12
DVDDIO_3V3  (via drill 0.5)
  Top 0.203: U$6.44 41.68,40.41 v42.42,41.15 | U$6.34 46.68,38.05 46.99,38.35 48.77,38.35 v49.53,37.59 | U$6.23 50.81,30.75 v51.05,30.99
  Bottom 0.61: 51.17,31.1 v51.05,30.99 52.16,30.99 C35.1 | C17.1 v42.42,41.15 | C24.1 49.28,37.85 v49.53,37.59
  Bottom 0.813: v51.05,30.99 51.05,37.59 | 51.05,37.59 51.05,41.91 50.04,42.93 43.43,42.93 | 43.43,42.93 42.42,42.93 v42.42,41.15 | v49.53,37.59 51.05,37.59 | 43.43,42.93 43.69,43.18 v43.69,54.61 43.69,54.86
  other vias: 43.69,53.34 43.69,52.07 43.69,50.8 43.69,49.53
  pour Top (no thermals): 41.15,55.12 41.15,49.02 44.45,49.02 44.45,55.12
GND  (via drill 0.3, 0.5, 2)
  Top 0.203: U$2.P$1 30.22,14.23 29.97,14.48 29.97,14.99 29.72,15.24 U$2.P$4 | U$1.P$2 45.4,14.29 U$4.P$34 U$4.P$5 | U$1.P$5 43.9,14.29 U$4.P$31 U$4.P$8 | U$1.P$8 42.4,14.29 U$4.P$28 U$4.P$11 | U$4.P$14 U$4.P$25 40.9,14.29 U$1.P$11
  other vias: 43.43,31.5 41.4,33.53 42.16,33.53 42.93,33.53 43.94,33.53 44.7,33.53 45.47,33.53 41.4,32.77 42.16,32.77 44.7,32.77 45.47,32.77 41.4,32 45.47,32 45.47,30.99 44.7,30.23 45.47,30.23 45.47,29.46 41.4,30.99 41.4,30.23 42.16,30.23 41.4,29.46 42.16,29.46 41.91,31.5 44.96,31.5 43.43,33.02 24.64,61.98 28.7,61.98 26.67,60.45 47.5,61.98 49.53,60.45 51.56,61.98 22.35,52.83 22.35,51.31 29.97,52.83 29.97,51.31 37.59,52.83 37.59,51.31 45.21,52.83 45.21,51.31 52.83,52.83 52.83,51.31 60.45,52.83 60.45,51.31 37.34,65.28 38.86,65.28 60.2,65.28 61.72,65.28 2.54,66.04 2.54,60.96 8.89,66.04 13.97,66.04 3.05,52.32 5.08,46.99 10.16,50.8 10.16,46.99 16.51,52.07 15.24,46.99 24.13,44.45 33.02,44.45 39.37,44.45 43.18,58.42 43.18,63.5 64.77,60.96 64.77,57.15 64.77,44.45 64.77,38.1 38.1,39.37 27.94,36.83 30.48,34.29 10.16,41.91 11.43,39.37 10.16,36.83 12.7,34.29 13.72,31.75 13.72,29.21 13.72,26.67 11.43,22.86 15.24,20.32 19.05,21.59 24.13,19.05 48.9,26.04 3.81,32.51 3.81,25.91 2.54,11.43 2.54,6.35 2.54,1.91 6.99,1.91 36.83,3.81 43.18,2.54 55.88,2.54 49.53,14.48 64.77,21.59 64.77,16.51 12.19,10.67 16,14.73 17.02,7.37 24.64,9.91 21.08,30.48 18.8,36.32 66.8,1.78 37.34,21.84 7.87,21.08
  pour Top (isolate 0.203, rank 2): 0,68.58 68.58,68.58 68.58,0 0,0
  pour Bottom (isolate 0.203): 0,68.58 68.58,68.58 68.58,0 0,0
  pour Top (no thermals): 25.15,53.59 22.61,53.59 22.61,48.51 25.15,48.51
  pour Top (no thermals): 30.23,53.59 32.77,53.59 32.77,48.51 30.23,48.51
  pour Top (no thermals): 40.39,53.59 37.85,53.59 37.85,48.51 40.39,48.51
  pour Top (no thermals): 48.01,53.59 45.47,53.59 45.47,48.51 48.01,48.51
  pour Top (no thermals): 55.63,53.59 53.09,53.59 53.09,48.51 55.63,48.51
  pour Top (no thermals): 63.25,53.59 60.96,53.59 60.96,48.77 63.25,48.77
  pour Top (no thermals): 24.89,63.25 28.45,63.25 28.45,60.96 24.89,60.96
  pour Top (no thermals): 34.29,65.53 39.37,65.53 39.37,62.48 36.83,62.48 36.83,62.99 34.29,62.99
  pour Top (no thermals): 47.75,63.25 51.05,63.25 51.82,60.96 47.75,60.96
  pour Top (no thermals): 57.15,65.53 62.23,65.53 62.23,62.48 59.69,62.48 59.69,62.99 57.15,62.99
HS
  Top 0.203: U$6.46 40.68,41.7 43.18,44.2 52.83,44.2 53.85,43.18 U$7.A17
LLC
  Top 0.203: U$6.25 51.57,31.75 53.09,30.23 53.09,22.1 54.86,20.32 U$7.A26
N$1
  Top 0.203: U$6.13 45.72,25.76 45.72,21.84 45.93,21.64 U$4.P$4 U$4.P$35 45.9,14.29 U$1.P$1
N$2
  Top 0.203: U$6.12 45.21,25.77 45.21,21.84 44.93,21.56 U$4.P$6 U$4.P$33 44.9,14.29 U$1.P$3
N$3
  Top 0.203: U$4.P$7 44.43,21.61 44.2,21.84 44.2,25.78 U$6.10 | 44.4,21.49 U$4.P$7 | U$1.P$4 44.4,14.29 U$4.P$32 U$4.P$7
N$4
  Top 0.203: U$6.9 43.69,21.84 43.43,21.58 U$4.P$9 U$4.P$30 43.4,14.29 U$1.P$6
N$5
  Top 0.203: U$6.7 42.67,25.78 42.67,21.84 42.93,21.59 U$4.P$10 U$4.P$29 42.93,8.6 U$1.P$7
N$6
  Top 0.203: U$6.6 42.16,25.78 42.16,21.84 41.93,21.61 U$4.P$12 U$4.P$27 41.9,14.29 U$1.P$9
N$7
  Top 0.203: U$6.4 41.15,25.76 41.15,21.84 41.43,21.57 U$4.P$13 U$4.P$26 41.43,8.6 U$1.P$10
N$8
  Top 0.203: U$6.3 40.64,25.75 40.64,21.84 40.43,21.63 U$4.P$15 U$4.P$24 40.4,14.29 U$1.P$12
N$13
  Top 0.203: U$1.P$13 39.9,14.29 U$4.P$23 39.93,15.7 39.62,16 37.85,16 37.59,15.75 37.59,13.97 37.34,13.72 R1.1
N$14
  Top 0.203: U$4.P$22 39.43,10.72 38.86,10.16 38.86,8.61 U$1.P$15 38.9,6.57 39.62,5.84 51.73,5.84 R2.1
N$15
  Top 0.203: U$4.P$21 38.93,10.99 38.35,10.41 38.35,8.61 U$1.P$16 38.35,8.53 38.35,5.84 39.62,4.57 51.73,4.57 R3.1
N$16
  Top 0.203: U$4.P$20 38.43,11.25 36.83,9.65 | 36.83,9.65 36.83,8.64 U$1.P$19 | 36.83,9.65 36.83,11.18 36.23,11.77 R6.2 34.71,11.68 33.53,11.68 33.27,11.94 33.27,14.99 33.03,15.23 U$2.P$3
N$18
  Top 0.203: U$5.12 19.55,12.71 20.07,12.19 20.07,11.18 19.81,10.92 14.22,10.92 10.67,7.37 SV1.2
N$19
  Top 0.813: LED2.A 16.51,66.04 R12.2
N$20
  Top 0.203: R8.1 38.1,25.65 38.35,25.4 38.35,24.38 39.43,23.31 U$4.P$17 39.37,20.17 39.37,18.54 38.86,18.03 27.69,18.03 27.18,18.54 27.18,27.94 27.94,28.7 37.69,28.7 U$6.62
N$21
  Top 0.813: IC2.2 33.02,64.11 | 33.12,57.91 IC2.4
  pour Top (no thermals): 32.26,65.02 32.26,62.48 29.97,62.48 29.97,59.18 26.16,59.18 23.62,56.64 23.62,54.1 24.89,54.1 24.89,55.63 31.24,55.63 31.24,54.1 32.51,54.1 32.51,55.63 38.86,55.63 38.86,54.1 40.13,54.1 40.13,60.45 39.12,61.47 37.08,61.47 36.07,62.48 33.78,62.48 33.78,65.02
N$22
  Top 0.813: IC1.4 54.78,57.81
  pour Top (no thermals): 55.12,65.02 55.12,62.48 52.83,62.48 52.83,59.18 48.77,59.18 46.48,56.9 46.48,54.1 47.75,54.1 47.75,55.63 54.1,55.63 54.1,54.1 55.37,54.1 55.37,55.63 61.72,55.63 61.72,54.1 62.99,54.1 62.99,60.45 61.72,61.47 59.94,61.47 58.93,62.48 56.64,62.48 56.64,65.02
N$23
  Top 0.203: R7.1 38.35,23.62 38.86,23.11 38.86,21.59 U$4.P$18 38.93,18.86 38.61,18.54 27.94,18.54 27.69,18.8 27.69,27.69 28.19,28.19 37.68,28.19 U$6.63
N$24
  Top 0.203: 36.32,17.53 39.12,17.53 39.88,18.29 39.88,20.17 U$4.P$16 | 36.32,17.53 27.43,17.53 26.67,18.29 26.67,28.19 27.69,29.21 37.7,29.21 U$6.61 | R9.1 36.41,17.44 36.32,17.53
N$25
  Top 0.203: U$6.59 32.53,30.25 32,29.72 25.23,29.72 R10.1 C2.2 21.68,26.25 Q1.1
N$26
  Top 0.203: U$6.58 32.5,30.75 32,31.24 25.23,31.24 R10.2 C3.2 21.68,34.71 Q1.2
N$27
  Top 0.203: U$7.A34 14.99,40.64 16.51,42.16 32.77,42.16 35.31,39.62 35.31,35.56 35.56,35.31 37.67,35.31 U$6.49
N$28
  Top 0.203: U$7.A35 13.21,38.1 16.76,41.66 32.51,41.66 34.8,39.37 34.8,35.05 35.05,34.8 37.68,34.8 U$6.50
N$29
  Top 0.203: U$7.A33 37.08,43.18 39.62,40.64 39.62,37.26 U$6.48
N$30
  Top 0.203: U$7.A37 10.41,33.02 | 10.41,33.02 14.22,33.02 15.49,34.29 15.49,38.86 17.27,40.64 32,40.64 33.78,38.86 33.78,33.78 34.29,33.27 37.71,33.27 U$6.53 | R13.1 10.41,31.75 10.41,33.02
N$31
  Top 0.203: U$7.A38 10.41,30.48 | 10.41,30.48 14.99,30.48 16,31.5 16,38.61 17.53,40.13 31.75,40.13 33.27,38.61 33.27,33.53 34.04,32.77 37.71,32.77 U$6.54 | R14.1 10.41,29.21 10.41,30.48
N$32
  Top 0.203: U$7.A39 15.24,27.94 16.51,29.21 16.51,38.35 17.78,39.62 31.5,39.62 32.77,38.35 32.77,33.27 33.78,32.26 U$6.55
N$33
  Top 0.203: U$6.56 33.53,31.75 32.26,33.02 32.26,38.1 31.24,39.12 18.03,39.12 17.02,38.1 17.02,26.67 15.75,25.4 10.41,25.4 | 10.41,25.4 U$7.A40 | R15.1 10.41,26.67 10.41,25.4
N$34
  Top 0.203: U$4.P$37 46.93,11.75 47.5,11.18 C1.1
N$35
  Top 0.203: U$5.9 12.2,12.71 10.41,10.92 10.41,9.14 U$7.A48
N$36
  Top 0.203: U$5.8 11.84,13.36 9.4,10.92 9.4,9.4 7.62,7.62 U$7.A47
N$37
  Top 0.203: U$5.7 11.47,14.01 7.62,10.16 U$7.A46
N$38
  Top 0.203: U$5.6 9.58,14.66 7.62,12.7 U$7.A45
N$39
  Top 0.203: U$5.5 6.42,15.31 U$7.A44
N$40
  Top 0.203: U$5.4 9.69,15.96 7.87,17.78 U$7.A43
N$41
  Top 0.203: U$5.3 10.82,16.61 7.62,19.81 6.86,19.81 U$7.A42
N$43
  Top 0.203: U$7.A36 13.97,35.56 14.99,36.58 14.99,39.12 17.02,41.15 32.26,41.15 34.29,39.12 34.29,34.8 34.8,34.29 37.69,34.29 U$6.51
N$44
  Top 0.203: U$5.18 21.74,16.61 25.91,12.45 SV1.14
N$45
  Top 0.203: U$5.17 21.38,15.96 23.62,13.72 23.62,9.65 23.37,9.4 SV1.12
N$46
  Top 0.203: U$5.16 21.01,15.31 22.86,13.46 22.86,10.16 20.83,8.13 SV1.10
N$47
  Top 0.203: U$5.15 20.64,14.66 22.1,13.21 22.1,10.41 20.57,8.89 19.05,8.89 18.29,8.13 SV1.8
N$48
  Top 0.203: U$5.14 20.28,14.01 21.34,12.95 21.34,10.67 20.07,9.4 17.02,9.4 15.75,8.13 SV1.6
N$49
  Top 0.203: U$5.13 19.91,13.36 20.57,12.7 20.57,10.92 19.81,10.16 16,10.16 13.21,7.37 SV1.4
N$50
  Top 0.203: U$5.1 12.57,17.91 7.62,22.86 U$7.A41
N$51
  Top 0.203: U$5.20 19.43,17.91 20.07,18.54 21.08,18.54 28.45,11.18 SV1.16
N$52
  Top 0.203: U$2.P$5 U$2.P$6 29.27,12.89 30.48,11.68 31.66,11.68 R5.1
N$53  (via drill 0.5)
  Top 0.203: U$6.64 29.78,27.75 v28.96,26.92 | U$1.P$18 37.4,7.17 36.83,6.6 36.32,6.6 35.81,7.11 35.81,9.06 R6.1 R5.2 30.06,10.07 v29.97,10.16
  Bottom 0.813: v28.96,26.92 26.92,26.92 26.42,26.42 26.42,10.67 26.92,10.16 v29.97,10.16
N$55
  Top 0.305: R4.1 32.6,21.5 32,22.1 28.99,22.1 LED1.A
N$56
  Top 0.203: 31.42,24.12 U$3.3
  Top 0.305: 31.42,24.12 28.96,24.12 LED1.C
N$57
  Top 0.203: U$4.P$19 38.43,20.39 38.1,20.07 34.54,20.07 34.04,20.57 34.04,25.91 | 34.04,25.91 34.04,26.42 34.29,26.67 38.1,26.67 39.12,25.65 39.54,25.65 U$6.1 | U$3.1 33.95,25.99 34.04,25.91
P0
  Top 0.203: U$6.43 42.18,39.64 44.96,42.42 53.09,42.42 54.86,40.64 U$7.A18
P1
  Top 0.203: U$6.42 42.68,39.38 45.21,41.91 52.83,41.91 55.37,39.37 60.96,39.37 U$7.B19
P2
  Top 0.203: U$6.41 43.18,39.12 45.47,41.4 52.58,41.4 55.88,38.1 U$7.A19
P3
  Top 0.203: U$6.39 44.18,39.36 45.72,40.89 52.32,40.89 56.39,36.83 60.96,36.83 U$7.B20
P4
  Top 0.203: U$6.38 44.68,39.1 45.97,40.39 52.07,40.39 56.9,35.56 U$7.A20
P5
  Top 0.203: U$6.37 45.18,38.83 46.23,39.88 51.82,39.88 57.4,34.29 60.96,34.29 U$7.B21
P6
  Top 0.203: U$6.36 45.68,38.57 46.48,39.37 51.56,39.37 57.91,33.02 U$7.A21
P7
  Top 0.203: U$6.35 46.18,38.31 46.74,38.86 51.31,38.86 58.42,31.75 60.96,31.75 U$7.B22
P8
  Top 0.203: U$6.33 48.15,37.2 49.53,35.81 53.59,35.81 58.93,30.48 U$7.A22
P9
  Top 0.203: U$6.32 53.4,35.25 56.64,32 56.64,30.23 57.66,29.21 60.96,29.21 U$7.B23
P10
  Top 0.203: U$6.31 53.14,34.75 56.13,31.75 56.13,28.7 56.9,27.94 U$7.A23
P11
  Top 0.203: U$6.30 52.88,34.25 55.63,31.5 55.63,27.69 56.64,26.67 60.96,26.67 U$7.B24
P12
  Top 0.203: U$6.29 52.61,33.75 55.12,31.24 55.12,25.91 55.63,25.4 U$7.A24
P13
  Top 0.203: U$6.28 52.35,33.25 54.61,30.99 54.61,24.89 55.37,24.13 60.96,24.13 U$7.B25
P14
  Top 0.203: U$6.27 52.09,32.75 54.1,30.73 54.1,23.37 54.61,22.86 U$7.A25
P15
  Top 0.203: U$6.26 51.83,32.25 53.59,30.48 53.59,22.35 54.36,21.59 60.96,21.59 U$7.B26
P16
  Top 0.203: U$6.22 51.03,30.25 52.58,28.7 52.58,21.84 55.37,19.05 60.96,19.05 U$7.B27
P17
  Top 0.203: U$6.21 50.77,29.75 52.07,28.45 52.07,21.59 55.88,17.78 U$7.A27
P18
  Top 0.203: U$6.20 50.51,29.25 51.56,28.19 51.56,21.34 56.39,16.51 60.96,16.51 U$7.B28
P19
  Top 0.203: U$6.19 50.25,28.75 51.05,27.94 51.05,21.08 56.9,15.24 U$7.A28
P20
  Top 0.203: U$6.18 49.99,28.25 50.55,27.69 50.55,20.83 57.4,13.97 60.96,13.97 U$7.B29
P21
  Top 0.203: U$6.17 49.13,27.57 50.04,26.67 50.04,20.57 57.91,12.7 U$7.A29
P22
  Top 0.203: U$6.16 47.36,25.8 49.53,23.62 49.53,20.32 58.42,11.43 60.96,11.43 U$7.B30
P23
  Top 0.203: U$6.15 46.68,24.94 46.99,24.64 47.5,24.64 49.02,23.11 49.02,20.07 58.93,10.16 U$7.A30
PVDD_1V8  (via drill 0.5)
  Top 0.203: U$6.57 33.02,31.25 32,32.26 27.18,32.26 v26.67,32.77
  Top 0.813: 58.93,52.07 C11.+
  Top 1.27: v19.56,46.74 57.91,46.74 58.93,47.75 58.93,52.07
  Bottom 0.61: C16.1 v26.67,32.77
  Bottom 0.813: v26.67,32.77 19.56,44.2 v19.56,46.74 19.56,46.99
  pour Top (no thermals): 56.39,55.12 56.39,49.02 59.69,49.02 59.69,55.12
TVDD_3V3  (via drill 0.5)
  Top 0.203: U$6.5 41.68,27.66 v41.66,27.69 | U$6.8 v43.18,27.68 v43.18,27.69 | U$6.11 44.68,27.67 v44.7,27.69
  Bottom 0.61: C36.1 v44.7,27.69 | C18.1 v41.66,27.69 | C25.1 43.04,27.83 v43.18,27.69
  Bottom 0.813: v44.7,27.69 44.7,26.67 44.2,26.16 43.18,26.16 | 43.18,26.16 41.66,26.16 | v43.18,27.69 43.18,26.16 | v41.66,27.69 41.66,26.16 | 41.66,26.16 36.07,26.16 35.31,26.92 35.31,45.72 36.07,46.48 v36.07,54.61 36.07,54.86
  other vias: 36.07,53.34 36.07,52.07 36.07,50.8 36.07,49.53
  pour Top (no thermals): 33.53,55.12 36.83,55.12 36.83,49.02 33.53,49.02
VCC_3V3  (via drill 0.5)
  Top 0.203: R1.2 R9.2 34.46,15.84 33.78,16.51 v29.97,16.51 | R8.2 R7.2 35.22,21.42 v35.31,21.34 | R4.2 v28.96,20.32 | U$4.P$2 46.93,17.59 v47.24,17.27 | U$2.P$2 31.5,14.73 v32,14.22
  Bottom 0.61: C19.1 v47.24,17.27
  Bottom 0.813: 33.02,21.08 33.02,40.13 28.45,44.7 v28.45,54.61 28.45,54.86 | 33.02,21.08 33.02,20.32 | 33.02,20.32 33.02,17.27 | 33.02,17.27 33.02,16.76 | 33.02,16.76 33.02,14.22 v32,14.22 | v35.31,21.34 33.27,21.34 33.02,21.08 | v47.24,17.27 33.02,17.27 | v28.96,20.32 33.02,20.32 | v29.97,16.51 32.77,16.51 33.02,16.76
  other vias: 28.45,53.34 28.45,52.07 28.45,50.8 28.45,49.53
  pour Top (no thermals): 25.91,55.12 25.91,49.02 28.96,49.02 28.96,55.12
VCC_5V0  (via drill 0.5)
  Top 0.203: R2.2 53.94,5.23 | 53.94,5.23 R3.2 | 53.94,5.23 55.22,5.23 v55.37,5.08 | U$4.P$1 47.43,19.88 v55.37,11.94 | U$5.19 20.31,17.26 v20.57,17.53
  Top 1.27: C4.1 19.05,63.63 F1.2 21.59,64.77 | 21.59,64.77 26.67,64.77 C6.1 26.67,67.31 30.48,67.31 | R12.1 21.59,66.04 21.59,64.77 | 30.48,67.31 49.53,67.31 | 49.53,67.31 C5.1 | IC2.3 30.48,64.11 30.48,67.31 | IC1.3 53.34,64.11 53.34,67.31 | 53.34,67.31 49.53,67.31 | 53.34,67.31 v66.8,67.06
  Bottom 0.61: 20.66,17.44 v20.57,17.53 C21.1 | C26.1 v55.37,11.94
  Bottom 0.813: 58.67,2.54 65.28,2.54 66.8,4.06 v66.8,62.99 v66.8,64.01 v66.8,65.02 v66.8,66.04 v66.8,67.06 66.8,67.31 | 58.67,2.54 58.67,2.79 57.4,4.06 57.4,5.08 | 57.4,5.08 57.4,11.18 56.64,11.94 v55.37,11.94 | 57.4,5.08 v55.37,5.08 | 58.67,2.54 56.9,0.76 30.99,0.76 30.48,1.27 30.48,6.35 29.21,7.62 21.59,7.62 20.32,8.89 20.32,17.27 v20.57,17.53
  pour Top (no thermals): 18.29,62.48 18.29,68.58 54.1,68.58 54.1,63.25 51.82,63.25 51.05,64.01 47.24,64.01 45.47,66.04 32,66.04 31.24,65.28 31.24,63.25 29.21,63.25 28.45,64.01 23.88,64.01 22.61,62.74 20.07,62.74 19.81,62.48
  pour Top (no thermals): 54.1,66.04 68.58,66.04 68.58,68.58 54.1,68.58
  pour Top (no thermals): 68.58,66.04 68.58,62.23 65.79,62.23 65.79,64.77 64.52,66.04
VS
  Top 0.203: U$6.47 40.18,42.22 42.67,44.7 53.09,44.7 53.34,44.45 60.96,44.45 U$7.B17

### Text on the board
tNames: 3V3 | 1V8 | AP | HS | VS | SCLK | P0 | DE | LRCLK | P2 | MCLK | P4 | SCL | P6 | SDA | P8 | INT1 | P10 | /RST | P12 | P14 | LCC | P17 | Papilio HDMI Receiver | v1.1 2014-06-25 | papilio@esar.org.uk | P19 | P21 | P23
bNames: VCC_5V0 | VCC_3V3 | TVDD_3V3 | DVDDIO_3V3 | DVDD_1V8 | CVDD_1V8 | PVDD_1V8